# EAGLE schematic HM_Nightfall-mini_v1 (EAGLE 9.6.2)
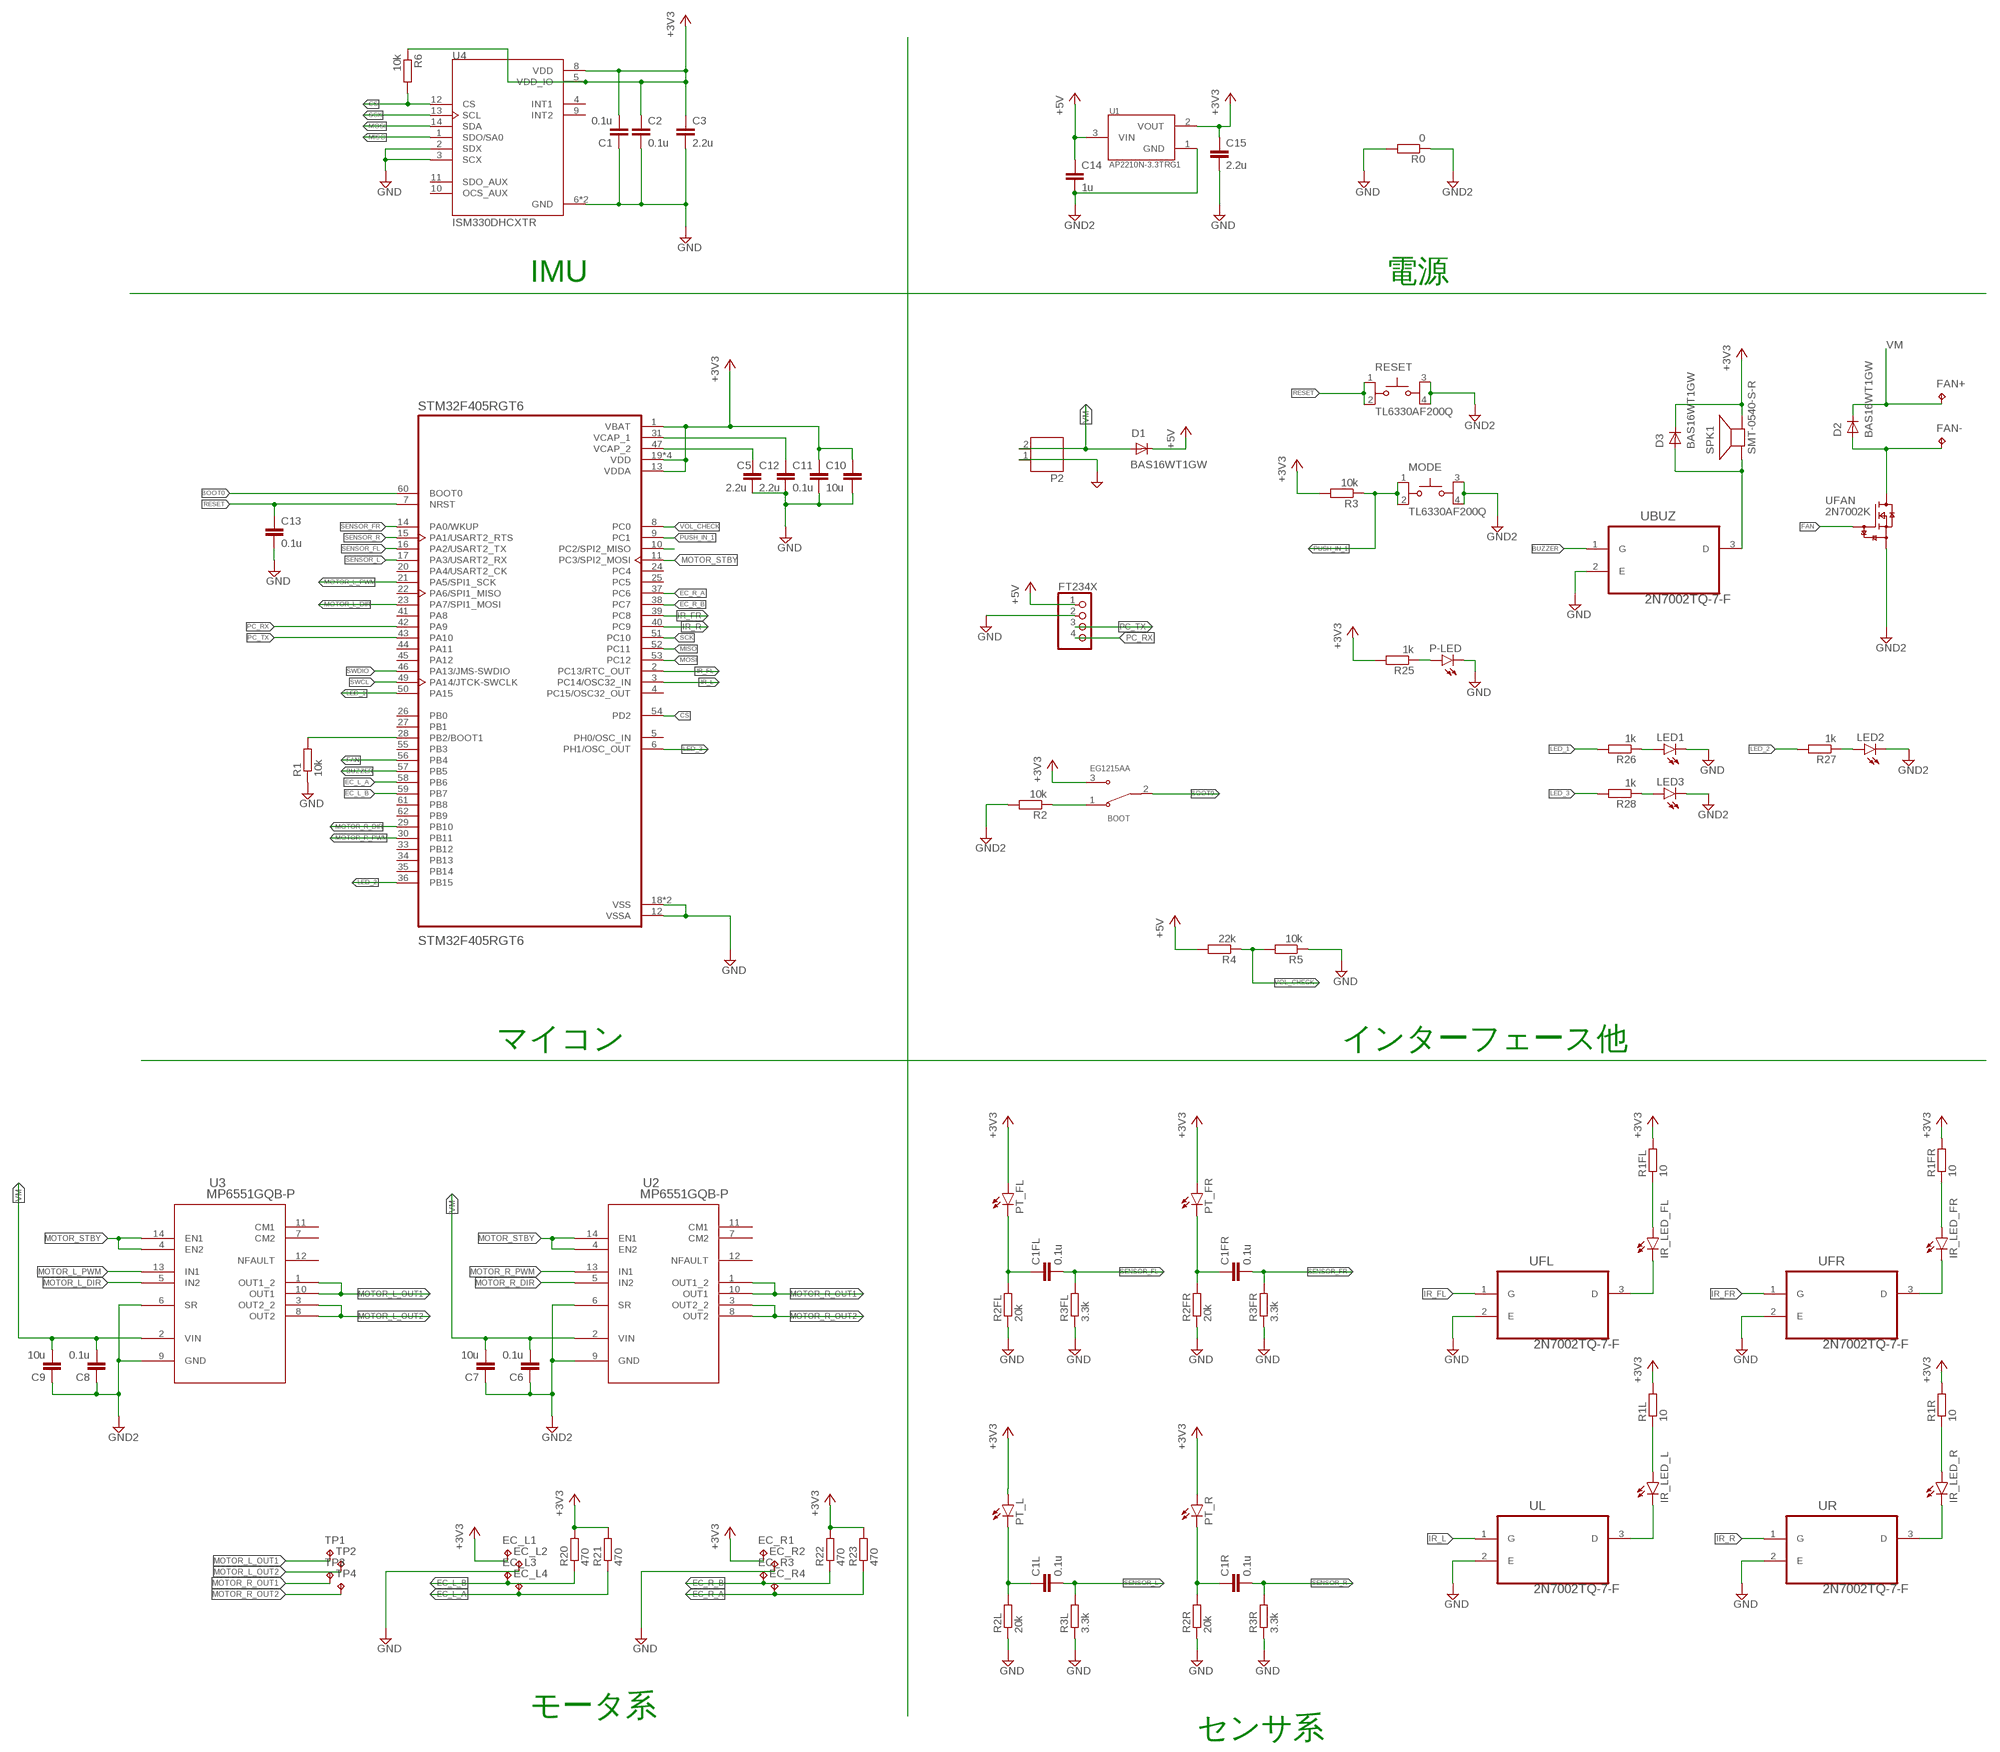
[diagram p0: schematic, sheet 1]

## Parts
BOOT  EG1215AA  [SW_EG1215AA]
C1  0.1u  C-EUC0402  [C0402]
C1FL  0.1u  C-EUC0402  [C0402]
C1FR  0.1u  C-EUC0402  [C0402]
C1L  0.1u  C-EUC0402  [C0402]
C1R  0.1u  C-EUC0402  [C0402]
C2  0.1u  C-EUC0402  [C0402]
C3  2.2u  C-EUC0402  [C0402]
C5  2.2u  C-EUC0402  [C0402]
C6  0.1u  C-EUC0402  [C0402]
C7  10u  C-EUC0402  [C0402]
C8  0.1u  C-EUC0402  [C0402]
C9  10u  C-EUC0402  [C0402]
C10  10u  C-EUC0402  [C0402]
C11  0.1u  C-EUC0402  [C0402]
C12  2.2u  C-EUC0402  [C0402]
C13  0.1u  C-EUC0402  [C0402]
C14  1u  C-EUC0402  [C0402]
C15  2.2u  C-EUC0402  [C0402]
D1  BAS16WT1GW  [SOT323]
D2  BAS16WT1GW  [SOT323]
D3  BAS16WT1GW  [SOT323]
EC_L1  TPB1,27  [B1,27]
EC_L2  TPB1,27  [B1,27]
EC_L3  TPB1,27  [B1,27]
EC_L4  TPB1,27  [B1,27]
EC_R1  TPB1,27  [B1,27]
EC_R2  TPB1,27  [B1,27]
EC_R3  TPB1,27  [B1,27]
EC_R4  TPB1,27  [B1,27]
FAN+  TPB1,27  [B1,27]
FAN-  TPB1,27  [B1,27]
FT234X  PINHD-1X4  [1X04]
IR_LED_FL  LED3MM  [LED3MM]
IR_LED_FR  LED3MM  [LED3MM]
IR_LED_L  LED3MM  [LED3MM]
IR_LED_R  LED3MM  [LED3MM]
LED1  LEDCHIPLED_0603  [CHIPLED_0603]
LED2  LEDCHIPLED_0603  [CHIPLED_0603]
LED3  LEDCHIPLED_0603  [CHIPLED_0603]
MODE  TL6330AF200Q  [SW_TL6330AF200Q]
P2  JST-PH2  [JST-PH2]
P-LED  LEDCHIPLED_0603  [CHIPLED_0603]
PT_FL  LED3MM  [LED3MM]
PT_FR  LED3MM  [LED3MM]
PT_L  LED3MM  [LED3MM]
PT_R  LED3MM  [LED3MM]
R0  0  R-EU_R0402  [R0402]
R1  10k  R-EU_R0402  [R0402]
R1FL  10  R-EU_R0402  [R0402]
R1FR  10  R-EU_R0402  [R0402]
R1L  10  R-EU_R0402  [R0402]
R1R  10  R-EU_R0402  [R0402]
R2  10k  R-EU_R0402  [R0402]
R2FL  20k  R-EU_R0402  [R0402]
R2FR  20k  R-EU_R0402  [R0402]
R2L  20k  R-EU_R0402  [R0402]
R2R  20k  R-EU_R0402  [R0402]
R3  10k  R-EU_R0402  [R0402]
R3FL  3.3k  R-EU_R0402  [R0402]
R3FR  3.3k  R-EU_R0402  [R0402]
R3L  3.3k  R-EU_R0402  [R0402]
R3R  3.3k  R-EU_R0402  [R0402]
R4  22k  R-EU_R0402  [R0402]
R5  10k  R-EU_R0402  [R0402]
R6  10k  R-EU_R0402  [R0402]
R20  470  R-EU_R0402  [R0402]
R21  470  R-EU_R0402  [R0402]
R22  470  R-EU_R0402  [R0402]
R23  470  R-EU_R0402  [R0402]
R25  1k  R-EU_R0402  [R0402]
R26  1k  R-EU_R0402  [R0402]
R27  1k  R-EU_R0402  [R0402]
R28  1k  R-EU_R0402  [R0402]
RESET  TL6330AF200Q  [SW_TL6330AF200Q]
SPK1  SMT-0540-S-R  [SMT-0540-S-R]
STM32F405RGT6  STM32F405RGT6  [QFP50P1200X1200X160-64N]
TP1  TPB1,27  [B1,27]
TP2  TPB1,27  [B1,27]
TP3  TPB1,27  [B1,27]
TP4  TPB1,27  [B1,27]
U1  AP2210N-3.3TRG1  [SOT95P280X145-3N]
U2  MP6551GQB-P  [QFN-14_MP6551_MNP]
U3  MP6551GQB-P  [QFN-14_MP6551_MNP]
U4  ISM330DHCXTR  [PQFN50P250X300X86-14N]
UBUZ  2N7002TQ-7-F  [SOT50P160X90-3N]
UFAN  2N7002K  [SOT23]
UFL  2N7002TQ-7-F  [SOT50P160X90-3N]
UFR  2N7002TQ-7-F  [SOT50P160X90-3N]
UL  2N7002TQ-7-F  [SOT50P160X90-3N]
UR  2N7002TQ-7-F  [SOT50P160X90-3N]

## Nets
+3V3 [power]: BOOT.3 C1.2 C2.1 C3.1 C10.1 C11.1 C15.1 D3.3(K) EC_L1.TP EC_R1.TP PT_FL.A PT_FR.A PT_L.A PT_R.A R1FL.2 R1FR.2 R1L.2 R1R.2 R3.2 R6.1 R20.2 R21.2 R22.2 R23.2 R25.2 SPK1.+(-) STM32F405RGT6.1(VBAT) STM32F405RGT6.13(VDDA) STM32F405RGT6.19(VDD) STM32F405RGT6.32(VDD) STM32F405RGT6.48(VDD) STM32F405RGT6.64(VDD) U1.2(VOUT) U4.5(VDD_IO) U4.8(VDD)
+5V [power]: C14.1 D1.3(K) FT234X.1 R4.2 U1.3(VIN)
BOOT0: BOOT.2 STM32F405RGT6.60(BOOT0)
BUZZER: STM32F405RGT6.57(PB5) UBUZ.1(G)
CS: R6.2 STM32F405RGT6.54(PD2) U4.12(CS)
EC_L_A: EC_L4.TP R21.1 STM32F405RGT6.58(PB6)
EC_L_B: EC_L3.TP R20.1 STM32F405RGT6.59(PB7)
EC_R_A: EC_R4.TP R23.1 STM32F405RGT6.37(PC6)
EC_R_B: EC_R3.TP R22.1 STM32F405RGT6.38(PC7)
FAN: STM32F405RGT6.56(PB4) UFAN.1(G)
GND [motor]: C1.1 C2.2 C3.2 C5.2 C10.2 C11.2 C12.2 C13.2 C15.2 EC_L2.TP EC_R2.TP FT234X.2 LED1.C P-LED.C R0.2 R1.1 R2FL.1 R2FR.1 R2L.1 R2R.1 R3FL.1 R3FR.1 R3L.1 R3R.1 R5.1 STM32F405RGT6.12(VSSA) STM32F405RGT6.18(VSS) STM32F405RGT6.63(VSS) U4.2(SDX) U4.3(SCX) U4.6(GND) U4.7(GND) UBUZ.2(E) UFL.2(E) UFR.2(E) UL.2(E) UR.2(E)
GND2 [motor]: C6.1 C7.1 C8.1 C9.1 C14.2 LED2.C LED3.C MODE.3 MODE.4 P2.1 R0.1 R2.2 RESET.3 RESET.4 U1.1(GND) U2.6(SR) U2.9(GND) U3.6(SR) U3.9(GND) UFAN.2(S)
IR_FL: STM32F405RGT6.2(PC13/RTC_OUT) UFL.1(G)
IR_FR: STM32F405RGT6.39(PC8) UFR.1(G)
IR_L: STM32F405RGT6.3(PC14/OSC32_IN) UL.1(G)
IR_R: STM32F405RGT6.40(PC9) UR.1(G)
LED_1: R26.2 STM32F405RGT6.50(PA15)
LED_2: R27.2 STM32F405RGT6.36(PB15)
LED_3: R28.2 STM32F405RGT6.6(PH1/OSC_OUT)
MISO: STM32F405RGT6.52(PC11) U4.1(SDO/SA0)
MOSI: STM32F405RGT6.53(PC12) U4.14(SDA)
MOTOR_L_DIR: STM32F405RGT6.23(PA7/SPI1_MOSI) U3.5(IN2)
MOTOR_L_OUT1 [motor]: TP1.TP U3.1(OUT1_2) U3.10(OUT1)
MOTOR_L_OUT2 [motor]: TP2.TP U3.3(OUT2_2) U3.8(OUT2)
MOTOR_L_PWM: STM32F405RGT6.21(PA5/SPI1_SCK) U3.13(IN1)
MOTOR_R_DIR: STM32F405RGT6.29(PB10) U2.5(IN2)
MOTOR_R_OUT1 [motor]: TP3.TP U2.1(OUT1_2) U2.10(OUT1)
MOTOR_R_OUT2 [motor]: TP4.TP U2.3(OUT2_2) U2.8(OUT2)
MOTOR_R_PWM: STM32F405RGT6.30(PB11) U2.13(IN1)
MOTOR_STBY: STM32F405RGT6.11(PC3/SPI2_MOSI) U2.4(EN2) U2.14(EN1) U3.4(EN2) U3.14(EN1)
N$1: D2.1(A) FAN-.TP UFAN.3(D)
N$2: IR_LED_FL.K(C) UFL.3(D)
N$3: C1FL.1 PT_FL.K(C) R2FL.2
N$6: C1FR.1 PT_FR.K(C) R2FR.2
N$8: IR_LED_FL.A R1FL.1
N$9: C1L.1 PT_L.K(C) R2L.2
N$10: IR_LED_L.K(C) UL.3(D)
N$12: C1R.1 PT_R.K(C) R2R.2
N$13: C5.1 STM32F405RGT6.47(VCAP_2)
N$14: C12.1 STM32F405RGT6.31(VCAP_1)
N$15 [motor]: R1.2 STM32F405RGT6.28(PB2/BOOT1)
N$16: IR_LED_L.A R1L.1
N$18: IR_LED_FR.K(C) UFR.3(D)
N$19: BOOT.1 R2.1
N$21: P-LED.A R25.1
N$23: D3.1(A) SPK1.-(+) UBUZ.3(D)
N$27: LED1.A R26.1
N$28: IR_LED_FR.A R1FR.1
N$29: IR_LED_R.K(C) UR.3(D)
N$30: IR_LED_R.A R1R.1
N$36: LED2.A R27.1
N$41: LED3.A R28.1
PC_RX: FT234X.4 STM32F405RGT6.42(PA9)
PC_TX: FT234X.3 STM32F405RGT6.43(PA10)
PUSH_IN_1: MODE.1 MODE.2 R3.1 STM32F405RGT6.9(PC1)
PUSH_IN_2: STM32F405RGT6.10(PC2/SPI2_MISO)
RESET: C13.1 RESET.1 RESET.2 STM32F405RGT6.7(NRST)
SCK: STM32F405RGT6.51(PC10) U4.13(SCL)
SENSOR_FL: C1FL.2 R3FL.2 STM32F405RGT6.16(PA2/USART2_TX)
SENSOR_FR: C1FR.2 R3FR.2 STM32F405RGT6.14(PA0/WKUP)
SENSOR_L: C1L.2 R3L.2 STM32F405RGT6.17(PA3/USART2_RX)
SENSOR_R: C1R.2 R3R.2 STM32F405RGT6.15(PA1/USART2_RTS)
SWCL: STM32F405RGT6.49(PA14/JTCK-SWCLK)
SWDIO: STM32F405RGT6.46(PA13/JMS-SWDIO)
VM [power]: C6.2 C7.2 C8.2 C9.2 D1.1(A) D2.3(K) FAN+.TP P2.2 U2.2(VIN) U3.2(VIN)
VOL_CHECK: R4.1 R5.2 STM32F405RGT6.8(PC0)
Unconnected: STM32F405RGT6.4(PC15/OSC32_OUT) STM32F405RGT6.5(PH0/OSC_IN) STM32F405RGT6.20(PA4/USART2_CK) STM32F405RGT6.22(PA6/SPI1_MISO) STM32F405RGT6.24(PC4) STM32F405RGT6.25(PC5) STM32F405RGT6.26(PB0) STM32F405RGT6.27(PB1) STM32F405RGT6.33(PB12) STM32F405RGT6.34(PB13) STM32F405RGT6.35(PB14) STM32F405RGT6.41(PA8) STM32F405RGT6.44(PA11) STM32F405RGT6.45(PA12) STM32F405RGT6.55(PB3) STM32F405RGT6.61(PB8) STM32F405RGT6.62(PB9) U2.7(CM2) U2.11(CM1) U2.12(NFAULT) U3.7(CM2) U3.11(CM1) U3.12(NFAULT) U4.4(INT1) U4.9(INT2) U4.10(OCS_AUX) U4.11(SDO_AUX)

## Notes on the sheet
- IMU | 電源
- マイコン | インターフェース他
- モータ系
- センサ系

## Library data of the parts
BOOT = EG1215AA:EG1215AA: Slide Switch SPDT Surface Mount, Right Angle Check availability <https://pricing.snapeda.com/parts/EG1215AA/E-Switch/view-part?ref=eda>; AVAILABILITY: In Stock; CHECK_PRICES: https://www.snapeda.com/parts/EG1215AA/E-Switch/view-part/?ref=eda; DESCRIPTION: Slide Switch SPDT Surface Mount, Right Angle; MF: E-Switch; MP: EG1215AA; PACKAGE: None; PRICE: None; PURCHASE-URL: https://www.snapeda.com/api/url_track_click_mouser/?unipart_id=3210616&manufacturer=E-Switch&part_name=EG1215AA&search_term=eg1215aa; SNAPEDA_LINK: https://www.snapeda.com/parts/EG1215AA/E-Switch/view-part/?ref=snap
C1 C1FL C1FR C1L C1R C2 C3 C5-C15 = rcl:C-EU: CAPACITOR, European symbol; SPICEPREFIX: C
D1-D3 = BAS16WT1G:BAS16WT1G: Check availability <https://pricing.snapeda.com/parts/BAS16WT1G/ON%20Semiconductor/view-part?ref=eda>; AVAILABILITY: In Stock; CHECK_PRICES: https://www.snapeda.com/parts/BAS16WT1G/Onsemi/view-part/?ref=eda; DESCRIPTION: DIODE, SIGNAL, 75V, SC70; Diode Type:Small Signal; Voltage, Vrrm:75V; Time, trr Typ:6ns; Voltage, Vf Max:1.25V; Temperature, Tj Max:150°C; Termination Type:SMD; Operating Temperature Range:-55°C to +150°C; Case Style:SC-70; No. of Pins:3; Voltage, Breakdown Max:75V; MF: ON Semiconductor; MP: BAS16WT1G; PACKAGE: SC-70-3 ON Semiconductor; PRICE: None; SNAPEDA_LINK: https://www.snapeda.com/parts/BAS16WT1G/Onsemi/view-part/?ref=snap
EC_L1-EC_L4 EC_R1-EC_R4 FAN+ FAN- TP1-TP4 = testpad:TP: Test pad
FT234X = pinhead:PINHD-1X4: PIN HEADER
IR_LED_FL IR_LED_FR IR_LED_L IR_LED_R LED1-LED3 P-LED PT_FL PT_FR PT_L PT_R = led:LED: LED OSRAM: - CHIPLED LG R971, LG N971, LY N971, LG Q971, LY Q971, LO R971, LY R971 LH N974, LH R974 LS Q976, LO Q976, LY Q976 LO Q996 - Hyper CHIPLED LW Q18S LB Q993, LB Q99A, LB R99A - SideLED LS A670, LO A670, LY A670, LG A670, LP A670 LB A673, LV A673, LT A673, LW A673 LH A674 LY A675 LS A676, LA A676, LO A676, LY A676, LW A676 LS A679, LY A679, LG A679 - Hyper Micro SIDELED® LS Y876, LA Y876, LO Y876, LY Y876 LT Y87S - SmartLED LW L88C, LW L88S LB L89C, LB L89S, LG L890 LS L89K, LO L89K, LY L89K LS L896, LA L896, LO L896, LY L896 - TOPLED LS T670, LO T670, LY T670, LG T670, LP T670 LSG T670, LSP T670, LSY T670, LOP T670, LYG T670 LG T671, LOG T671, LSG T671 LB T673, LV T673, LT T673, LW T673 LH T674 LS T676, LA T676, LO T676, LY T676, LB T676, LH T676, LSB T676, LW T676 LB T67C, LV T67C, LT T67C, LS T67K, LO T67K, LY T67K, LW E67C LS E67B, LA E67B, LO E67B, LY E67B, LB E67C, LV E67C, LT E67C LW T67C LS T679, LY T679, LG T679 LS T770, LO T770, LY T770, LG T770, LP T770 LB T773, LV T773, LT T773, LW T773 LH T774 LS E675, LA E675, LY E675, LS T675 LS T776, LA T776, LO T776, LY T776, LB T776 LHGB T686 LT T68C, LB T68C - Hyper Mini TOPLED® LB M676 - Mini TOPLED Santana® LG M470 LS M47K, LO M47K, LY M47K Source: http://www.osram.convergy.de LUXEON: - LUMILED® LXK2-PW12-R00, LXK2-PW12-S00, LXK2-PW14-U00, LXK2-PW14-V00 LXK2-PM12-R00, LXK2-PM12-S00, LXK2-PM14-U00 LXK2-PE12-Q00, LXK2-PE12-R00, LXK2-PE12-S00, LXK2-PE14-T00, LXK2-PE14-U00 LXK2-PB12-K00, LXK2-PB12-L00, LXK2-PB12-M00, LXK2-PB14-N00, LXK2-PB14-P00, LXK2-PB14-Q00 LXK2-PR12-L00, LXK2-PR12-M00, LXK2-PR14-Q00, LXK2-PR14-R00 LXK2-PD12-Q00, LXK2-PD12-R00, LXK2-PD12-S00 LXK2-PH12-R00, LXK2-PH12-S00 LXK2-PL12-P00, LXK2-PL12-Q00, LXK2-PL12-R00 Source: www.luxeon.com KINGBRIGHT: KA-3528ASYC Source: www.kingbright.com
MODE RESET = TL6330AF200Q:TL6330AF200Q: Check availability <https://pricing.snapeda.com/parts/TL6330AF200Q/E-Switch/view-part?ref=eda>; AVAILABILITY: In Stock; CHECK_PRICES: https://www.snapeda.com/parts/TL6330AF200Q/E-Switch/view-part/?ref=eda; DESCRIPTION: Tactile Switch SPST-NO Top Actuated Surface Mount; MF: E-Switch; MP: TL6330AF200Q; PACKAGE: None; PRICE: None; PURCHASE-URL: https://www.snapeda.com/api/url_track_click_mouser/?unipart_id=2720563&manufacturer=E-Switch&part_name=TL6330AF200Q&search_term=tl6330af200q; SNAPEDA_LINK: https://www.snapeda.com/parts/TL6330AF200Q/E-Switch/view-part/?ref=snap
P2 = jst-ph:JST-PH2
R0 R1 R1FL R1FR R1L R1R R2 R2FL R2FR R2L R2R R3 R3FL R3FR R3L R3R R4-R6 R20-R23 R25-R28 = rcl:R-EU_: RESISTOR, European symbol; SPICEPREFIX: R
SPK1 = SMT-0540-S-R:SMT-0540-S-R: SMT-0549-S-R Small surface-mount magnetic buzzer; DESCRIPTION: Buzzers Transducer, Externally Driven Electromechanical/Magnetic 3V 100mA 4kHz 78dB @ 3V, 10cm Surface Mount Solder Pads; DIGI-KEY_PART_NUMBER: 668-1060-1-ND; MF: PUI; MP: SMT-0540-S-R; PACKAGE: PUI; PURCHASE-URL: https://pricing.snapeda.com/search/part/SMT-0540-S-R/?ref=eda
STM32F405RGT6 = stm32_f405rgt6:STM32F405RGT6: High-performance foundation line, ARM Cortex-M4 core with DSP and FPU, 1 Mbyte Flash, 168 MHz CPU, ART Accelerator; AVAILABILITY: Unavailable; DESCRIPTION: ARM® Cortex®-M4 STM32F4 Microcontroller IC 32-Bit 168MHz 1MB (1M x 8) FLASH 64-LQFP (10x10); MF: STMicroelectronics; MP: STM32F405RGT6; PACKAGE: LQFP-64 STMicroelectronics; PRICE: None
U1 = AP2210N-3.3TRG1:AP2210N-3.3TRG1: LDO Regulator Pos 5V 0.3A 3-Pin SOT-23 T/R Check availability <https://pricing.snapeda.com/parts/AP2210N-3.3TRG1/Diodes%20Inc./view-part?ref=eda>; AVAILABILITY: In Stock; CHECK_PRICES: https://www.snapeda.com/parts/AP2210N-3.3TRG1/Diodes+Inc./view-part/?ref=eda; DESCRIPTION: Voltage Regulators, LDO, 300mA CMOS LDO 3.3V 250mV | Diodes Inc AP2210N-3.3TRG1; MF: Diodes Inc.; MP: AP2210N-3.3TRG1; PACKAGE: SOT-23-3 Diodes Inc.; PRICE: None; PURCHASE-URL: https://www.snapeda.com/api/url_track_click_mouser/?unipart_id=492437&manufacturer=Diodes Inc.&part_name=AP2210N-3.3TRG1&search_term=ldo 3.3v; SNAPEDA_LINK: https://www.snapeda.com/parts/AP2210N-3.3TRG1/Diodes+Inc./view-part/?ref=snap
U2 U3 = MP6551:MP6551GQB-P; COPYRIGHT: Copyright (C) 2025 Ultra Librarian. All rights reserved.; MANUFACTURER_PART_NUMBER: MP6551GQB-P; MFR_NAME: Monolithic Power Systems
U4 = ISM330DHCXTR:ISM330DHCXTR: Check availability <https://pricing.snapeda.com/parts/ISM330DHCXTR/STMicroelectronics/view-part?ref=eda>; AVAILABILITY: In Stock; CHECK_PRICES: https://www.snapeda.com/parts/ISM330DHCXTR/STMicroelectronics/view-part/?ref=eda; DESCRIPTION: Accelerometer, Gyroscope, Temperature, 6 Axis Sensor I2C, SPI Output; MF: STMicroelectronics; MP: ISM330DHCXTR; PACKAGE: VFLGA-14 STMicroelectronics; PRICE: None; SNAPEDA_LINK: https://www.snapeda.com/parts/ISM330DHCXTR/STMicroelectronics/view-part/?ref=snap
UBUZ UFL UFR UL UR = 2N7002TQ-7-F:2N7002TQ-7-F: Check availability <https://pricing.snapeda.com/parts/2N7002TQ-7-F/Diodes%20Inc./view-part?ref=eda>; AVAILABILITY: In Stock; CHECK_PRICES: https://www.snapeda.com/parts/2N7002TQ-7-F/Diodes+Inc./view-part/?ref=eda; DESCRIPTION: N-Channel 60 V 115mA (Ta) 150mW (Ta) Surface Mount SOT-523; MF: Diodes Inc.; MP: 2N7002TQ-7-F; PACKAGE: SOT-523 Diodes Inc.; PRICE: None; SNAPEDA_LINK: https://www.snapeda.com/parts/2N7002TQ-7-F/Diodes+Inc./view-part/?ref=snap
UFAN = nxp_60:2N7002K: N-channel TrenchMOS FET N-channel enhancement mode Field-Effect Transistor (FET) in a plastic package using TrenchMOS technology. AAL Eindhoven MK

## Net classes
1 power: width 0.152 mm
2 motor: width 0.152 mm